# EAGLE design arduino rx (EAGLE 9.4.0)
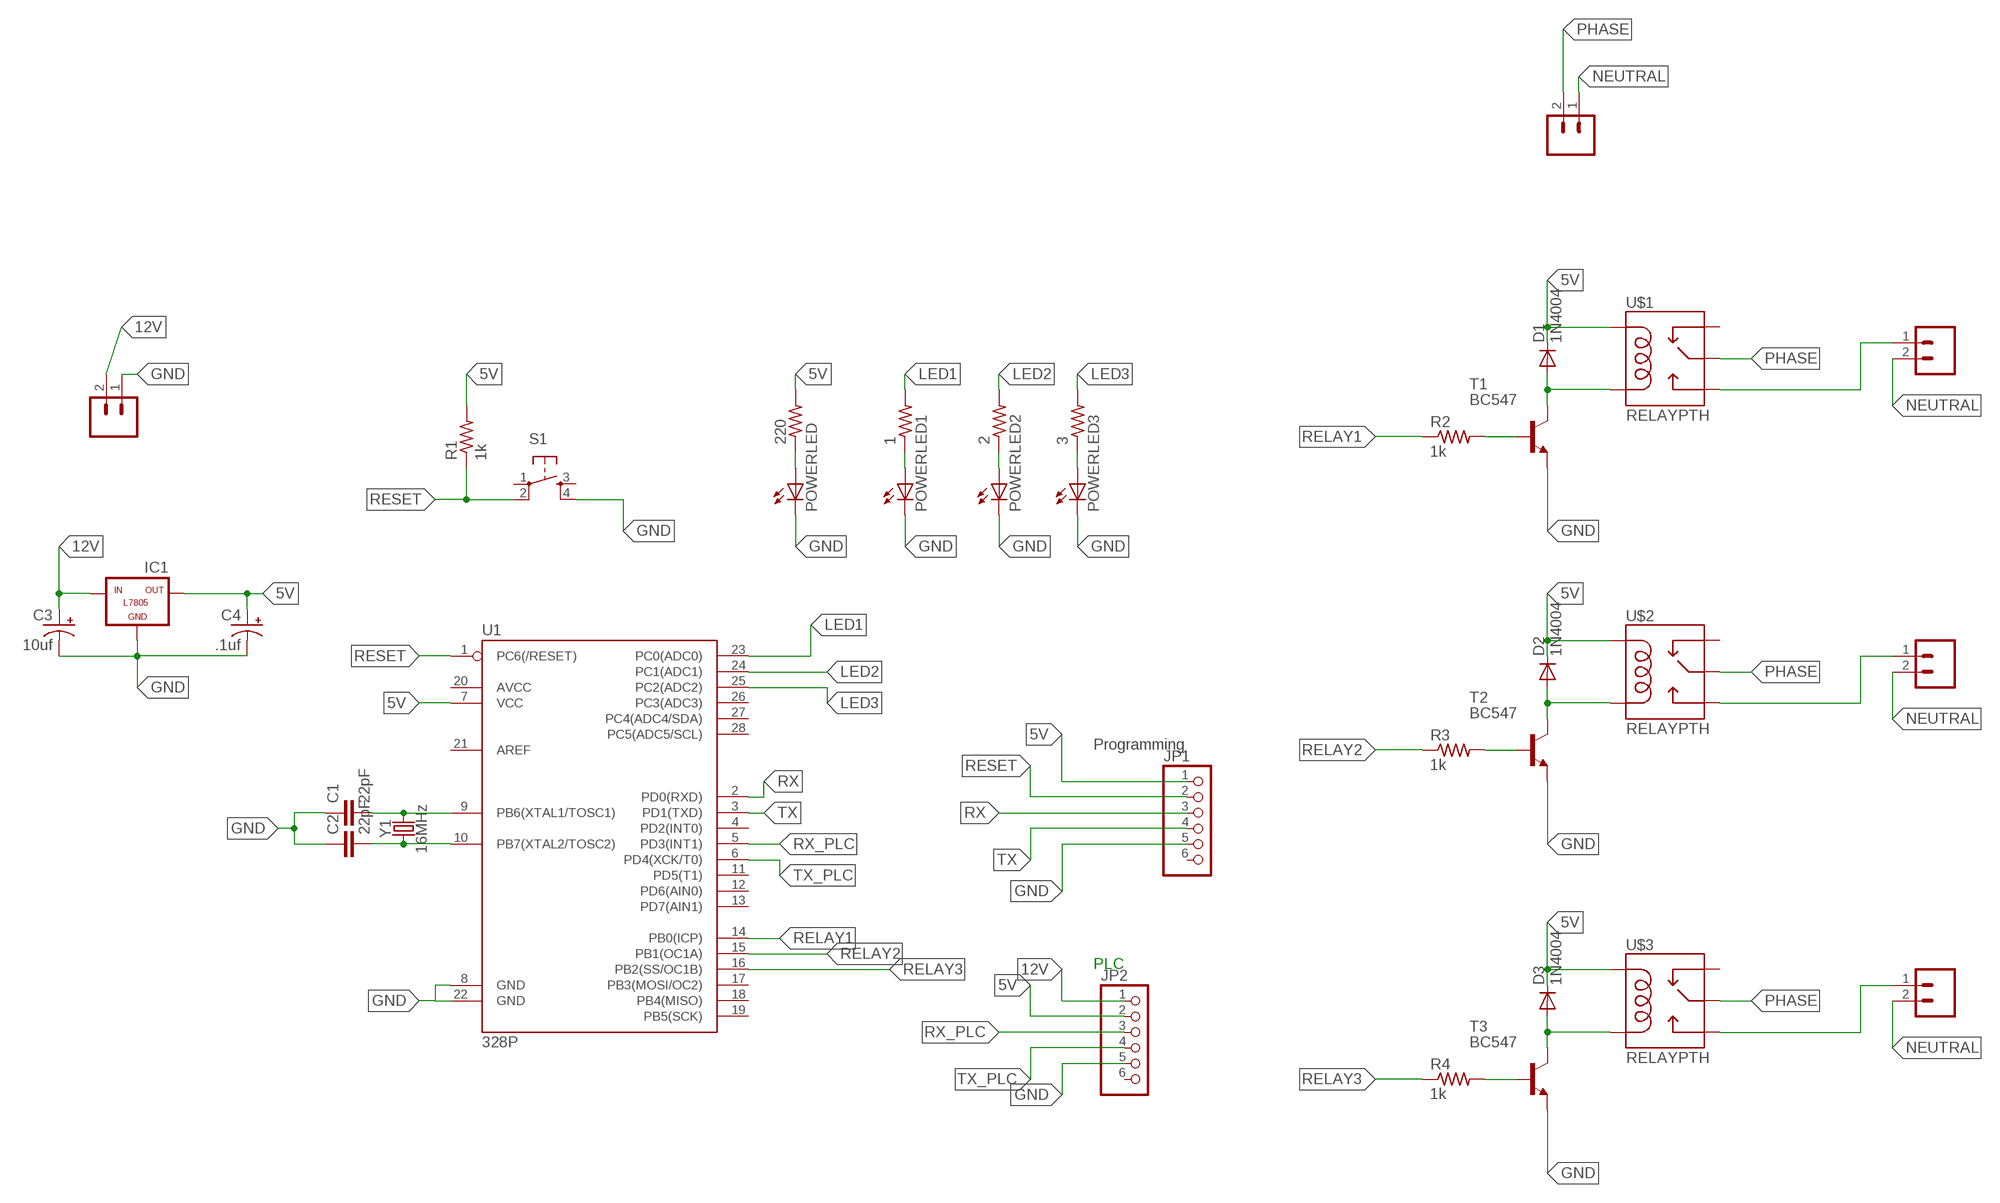
[diagram p0: schematic, sheet 1]

## Parts
1  R-US_0204/5  [0204/5]
2  R-US_0204/5  [0204/5]
3  R-US_0204/5  [0204/5]
220  R-US_0204/5  [0204/5]
C1  22pF  22PF-PTH-2.54MM-200V-5%  [CAP-PTH-2.54]
C2  22pF  22PF-PTH-2.54MM-200V-5%  [CAP-PTH-2.54]
C3  10uf  CPOL-USE5-5  [E5-5]
C4  .1uf  CPOL-USE5-5  [E5-5]
D1  1N4004  [DO41-10]
D2  1N4004  [DO41-10]
D3  1N4004  [DO41-10]
IC1  L7805  [78XXL]
J1  CONN_023.5MM  [SCREWTERMINAL-3.5MM-2]
J2  CONN_023.5MM  [SCREWTERMINAL-3.5MM-2]
J4  CONN_023.5MM  [SCREWTERMINAL-3.5MM-2]
J5  CONN_023.5MM  [SCREWTERMINAL-3.5MM-2]
J6  CONN_023.5MM  [SCREWTERMINAL-3.5MM-2]
JP1  PINHD-1X6  [1X06]
JP2  PINHD-1X6  [1X06]
POWERLED  LED5MM  [LED5MM]
POWERLED1  LED5MM  [LED5MM]
POWERLED2  LED5MM  [LED5MM]
POWERLED3  LED5MM  [LED5MM]
R1  1k  R-US_0204/5  [0204/5]
R2  1k  R-US_0204/5  [0204/5]
R3  1k  R-US_0204/5  [0204/5]
R4  1k  R-US_0204/5  [0204/5]
S1  TAC_SWITCHPTH  [TACTILE-PTH]
T1  BC547  [TO92]
T2  BC547  [TO92]
T3  BC547  [TO92]
U1  328P  ATMEGA328P_PDIP  [DIP28]
U$1  RELAYPTH  [SRD-05VDC-SL-C]
U$2  RELAYPTH  [SRD-05VDC-SL-C]
U$3  RELAYPTH  [SRD-05VDC-SL-C]
Y1  16MHz  CRYSTAL-16MHZPTH-HC49US  [HC49US]

## Nets
5V: 220.2 C4.+ D1.C D2.C D3.C IC1.OUT JP1.1 JP2.2 R1.2 U1.7(VCC) U$1.COIL1 U$2.COIL1 U$3.COIL1
12V: C3.+ IC1.IN J1.2 JP2.1
GND: C1.1 C2.1 C3.- C4.- IC1.GND J1.1 JP1.5 JP2.5 POWERLED1.K(C) POWERLED2.K(C) POWERLED3.K(C) POWERLED.K(C) S1.4 T1.1(E) T2.1(E) T3.1(E) U1.8(GND) U1.22(GND)
LED1: 1.2 U1.23(PC0(ADC0))
LED2: 2.2 U1.24(PC1(ADC1))
LED3: 3.2 U1.25(PC2(ADC2))
N$1: 220.1 POWERLED.A
N$2: C1.2 U1.9(PB6(XTAL1/TOSC1)) Y1.2
N$3: C2.2 U1.10(PB7(XTAL2/TOSC2)) Y1.1
N$4: R2.2 T1.2(B)
N$5: D1.A T1.3(C) U$1.COIL0
N$6: R3.2 T2.2(B)
N$7: D2.A T2.3(C) U$2.COIL0
N$8: J5.1 U$2.SWOPEN
N$9: J4.1 U$1.SWOPEN
N$10: J6.1 U$3.SWOPEN
N$12: R4.2 T3.2(B)
N$13: D3.A T3.3(C) U$3.COIL0
N$16: 1.1 POWERLED1.A
N$17: 2.1 POWERLED2.A
N$18: 3.1 POWERLED3.A
NEUTRAL: J2.1 J4.2 J5.2 J6.2
PHASE: J2.2 U$1.SWCOMMON U$2.SWCOMMON U$3.SWCOMMON
RELAY1: R2.1 U1.14(PB0(ICP))
RELAY2: R3.1 U1.15(PB1(OC1A))
RELAY3: R4.1 U1.16(PB2(SS/OC1B))
RESET: JP1.2 R1.1 S1.2 U1.1(PC6(/RESET))
RX: JP1.3 U1.2(PD0(RXD))
RX_PLC: JP2.3 U1.5(PD3(INT1))
TX: JP1.4 U1.3(PD1(TXD))
TX_PLC: JP2.4 U1.6(PD4(XCK/T0))
Unconnected: JP1.6 JP2.6 S1.1 S1.3 U1.4(PD2(INT0)) U1.11(PD5(T1)) U1.12(PD6(AIN0)) U1.13(PD7(AIN1)) U1.17(PB3(MOSI/OC2)) U1.18(PB4(MISO)) U1.19(PB5(SCK)) U1.20(AVCC) U1.21(AREF) U1.26(PC3(ADC3)) U1.27(PC4(ADC4/SDA)) U1.28(PC5(ADC5/SCL)) U$1.SWCLOSED(SWCLOSE) U$2.SWCLOSED(SWCLOSE) U$3.SWCLOSED(SWCLOSE)

## Notes on the sheet
- Programming
- PLC

## Library data of the parts
1-3 220 R1-R4 = adafruit:R-US_: RESISTOR, American symbol
C1 C2 = SparkFun-Capacitors:22PF: 22pF ceramic capacitors A capacitor is a passive two-terminal electrical component used to store electrical energy temporarily in an electric field.; PROD_ID: CAP-09128
C3 C4 = adafruit:CPOL-US: POLARIZED CAPACITOR, American symbol
D1-D3 = adafruit:1N4004: DIODE General purpose 1N400x type rectifier (With bigger pads) http://www.ladyada.net/library/pcb/eaglelibrary.html
IC1 = tango:L7805: VOLTAGE REGULATOR
J1 J2 J4-J6 = SparkFun-Connectors:CONN_02: Multi connection point. Often used as Generic Header-pin footprint for 0.1 inch spaced/style header connections On any of the 0.1 inch spaced packages, you can populate with these: Break Away Headers - Straight <https://www.sparkfun.com/products/116> (PRT-00116) Break Away Male Headers - Right Angle <https://www.sparkfun.com/products/553> (PRT-00553) Female Headers <https://www.sparkfun.com/products/115> (PRT-00115) Break Away Headers - Machine Pin <https://www.sparkfun.com/products/117> (PRT-00117) Break Away Female Headers - Swiss Machine Pin <https://www.sparkfun.com/products/743> (PRT-00743) For SCREWTERMINALS and SPRING TERMINALS visit here: Screw Terimnals on SparkFun.com <https://www.sparkfun.com/search/results?term=Screw+Terminals> (5mm/3.5mm/2.54mm spacing) This device is also useful as a general connection point to wire up your design to another part of your project. Our various solder wires solder well into these plated through hole pads. Hook-Up Wire - Assortment (Stranded, 22 AWG) <https://www.sparkfun.com/products/11375> (PRT-11375) Hook-Up Wire - Assortment (Solid Core, 22 AWG) <https://www.sparkfun.com/products/11367> (PRT-11367) View the entire wire category on our website here <https://www.sparkfun.com/categories/141> Special notes: Molex polarized connector foot print use with: PRT-08233 with associated crimp pins and housings. 2.54_SCREWTERM for use with PRT-10571. 3.5mm Screw Terminal footprints for PRT-08084 5mm Screw Terminal footprints for use with PRT-08432; PROD_ID: CONN-08399
JP1 JP2 = adafruit:PINHD-1X6: PIN HEADER
POWERLED POWERLED1-POWERLED3 = adafruit:LED: LED OSRAM: - CHIPLED LG R971, LG N971, LY N971, LG Q971, LY Q971, LO R971, LY R971 LH N974, LH R974 LS Q976, LO Q976, LY Q976 LO Q996 - Hyper CHIPLED LW Q18S LB Q993, LB Q99A, LB R99A - SideLED LS A670, LO A670, LY A670, LG A670, LP A670 LB A673, LV A673, LT A673, LW A673 LH A674 LY A675 LS A676, LA A676, LO A676, LY A676, LW A676 LS A679, LY A679, LG A679 - Hyper Micro SIDELED® LS Y876, LA Y876, LO Y876, LY Y876 LT Y87S - SmartLED LW L88C, LW L88S LB L89C, LB L89S, LG L890 LS L89K, LO L89K, LY L89K LS L896, LA L896, LO L896, LY L896 - TOPLED LS T670, LO T670, LY T670, LG T670, LP T670 LSG T670, LSP T670, LSY T670, LOP T670, LYG T670 LG T671, LOG T671, LSG T671 LB T673, LV T673, LT T673, LW T673 LH T674 LS T676, LA T676, LO T676, LY T676, LB T676, LH T676, LSB T676, LW T676 LB T67C, LV T67C, LT T67C, LS T67K, LO T67K, LY T67K, LW E67C LS E67B, LA E67B, LO E67B, LY E67B, LB E67C, LV E67C, LT E67C LW T67C LS T679, LY T679, LG T679 LS T770, LO T770, LY T770, LG T770, LP T770 LB T773, LV T773, LT T773, LW T773 LH T774 LS E675, LA E675, LY E675, LS T675 LS T776, LA T776, LO T776, LY T776, LB T776 LHGB T686 LT T68C, LB T68C - Hyper Mini TOPLED® LB M676 - Mini TOPLED Santana® LG M470 LS M47K, LO M47K, LY M47K Source: http://www.osram.convergy.de/
S1 = SparkFun-Retired:TAC_SWITCH: Momentary Switch Button commonly used for reset or general input. Spark Fun Electronics SKU : COM-00097 SMT- SWCH-08247
T1-T3 = transistor:BC547: NPN TRANSISTOR
U1 = SparkFun-IC-Microcontroller:ATMEGA328P_PDIP: Atmel 328P Through hole ATMEGA328P uC used in the Arduino 32kb flash, 1k EEPROM, 2k SRAM Datasheet <http://www.sparkfun.com/datasheets/Components/SMD/ATMega328.pdf> SparkFun Products Storefront component: AVR 28 Pin 20MHz 32K 6A/D - ATMega328P <https://www.sparkfun.com/products/9061> (COM-09061) SparkFun Simon Says - Through-Hole Soldering Kit <https://www.sparkfun.com/products/10547> (KIT-10547) SparkFun Learn to Solder - Simon Says <https://www.sparkfun.com/products/13708> (KIT-13708) SparkFun BigTime Watch Kit <https://www.sparkfun.com/products/11734> (KIT-11734) SparkFun ClockIt <https://www.sparkfun.com/products/10930> (KIT-10930) SparkFun Serial Enabled LCD Kit <https://www.sparkfun.com/products/10097> (LCD-10097) SparkFun Simon Tilts - Through Hole Soldering Kit <https://www.sparkfun.com/products/12634> (KIT-12634) SparkFun Frequency Counter Kit <https://www.sparkfun.com/products/10140> (KIT-10140) FabFM Radio Kit <https://www.sparkfun.com/products/11043> (KIT-11043) SparkFun Binary Blaster Kit <https://www.sparkfun.com/products/12037> (KIT-12037) SparkFun Metro-Gnome <https://www.sparkfun.com/products/9236> (KIT-09236) ATmega328 with Arduino Optiboot (Uno) <https://www.sparkfun.com/products/10524> (DEV-10524); PROD_ID: IC-09136
U$1-U$3 = SRD-05VDC-SL-C:RELAY: SPDT relay (COM-00101)
Y1 = SparkFun-Clocks:CRYSTAL-16MHZ: 16MHz Crystal Digikey Example <http://www.digikey.com/product-search/en?keywords=535-9122-1-ND> Frequency: 16MHz Frequency Stability: ±50ppm Frequency Tolerance: ±20ppm Load Capacitance: 18pF SparkFun Products: Pro Micro -5V/16MHz <https://www.sparkfun.com/products/12640> SparkFun Serial Enabled LCD Kit <https://www.sparkfun.com/products/10097>; PROD_ID: XTAL-08181; SF_ID: COM-00536

## Board
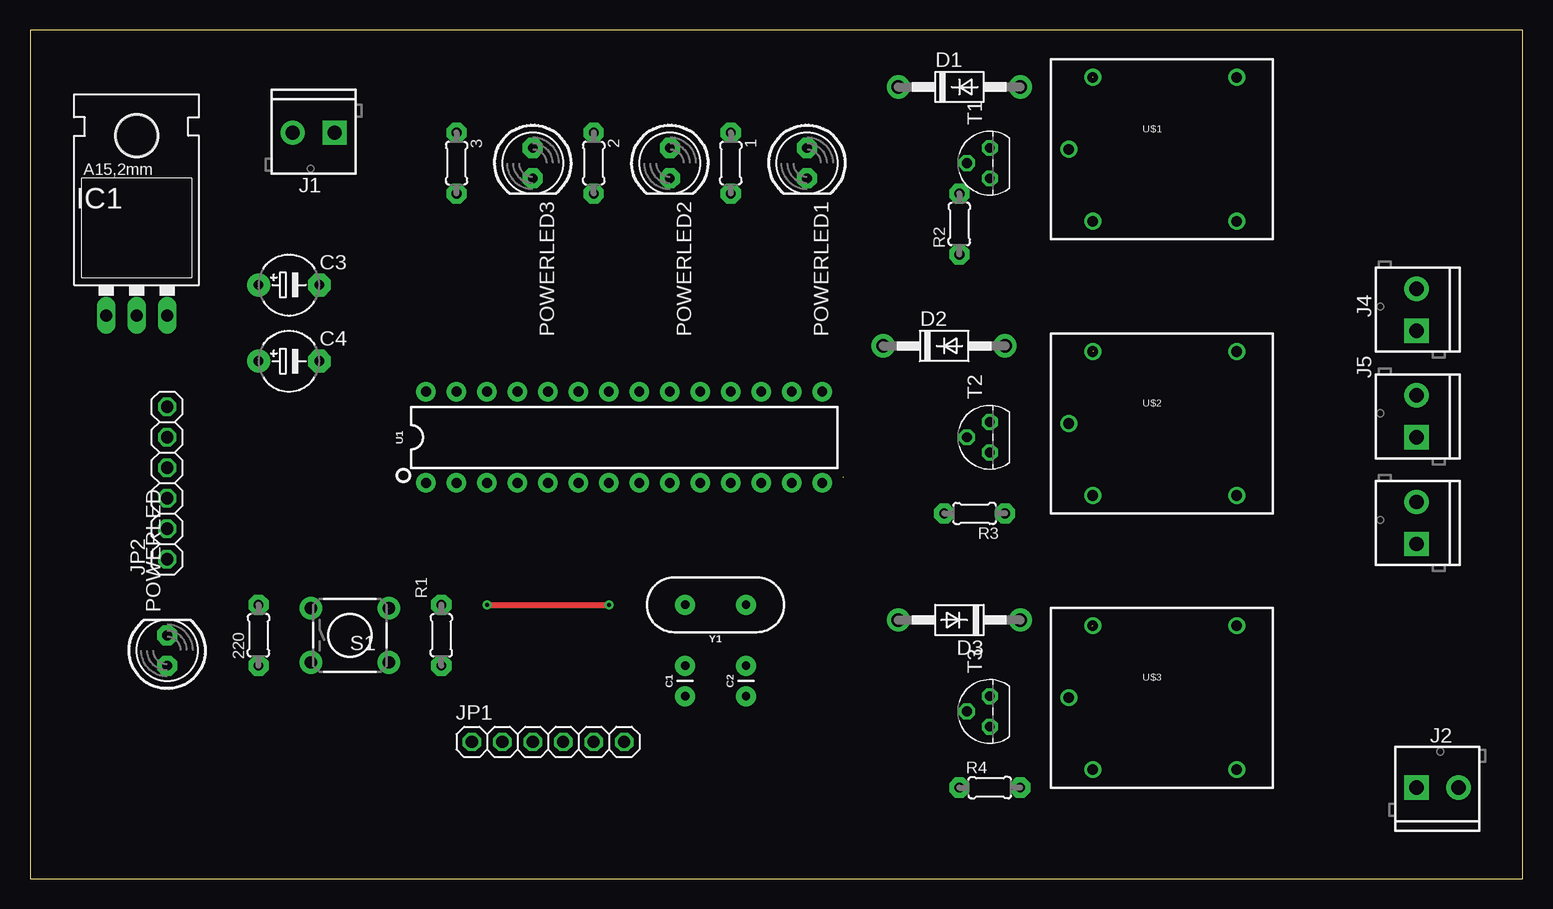
[diagram p1: board, top side]
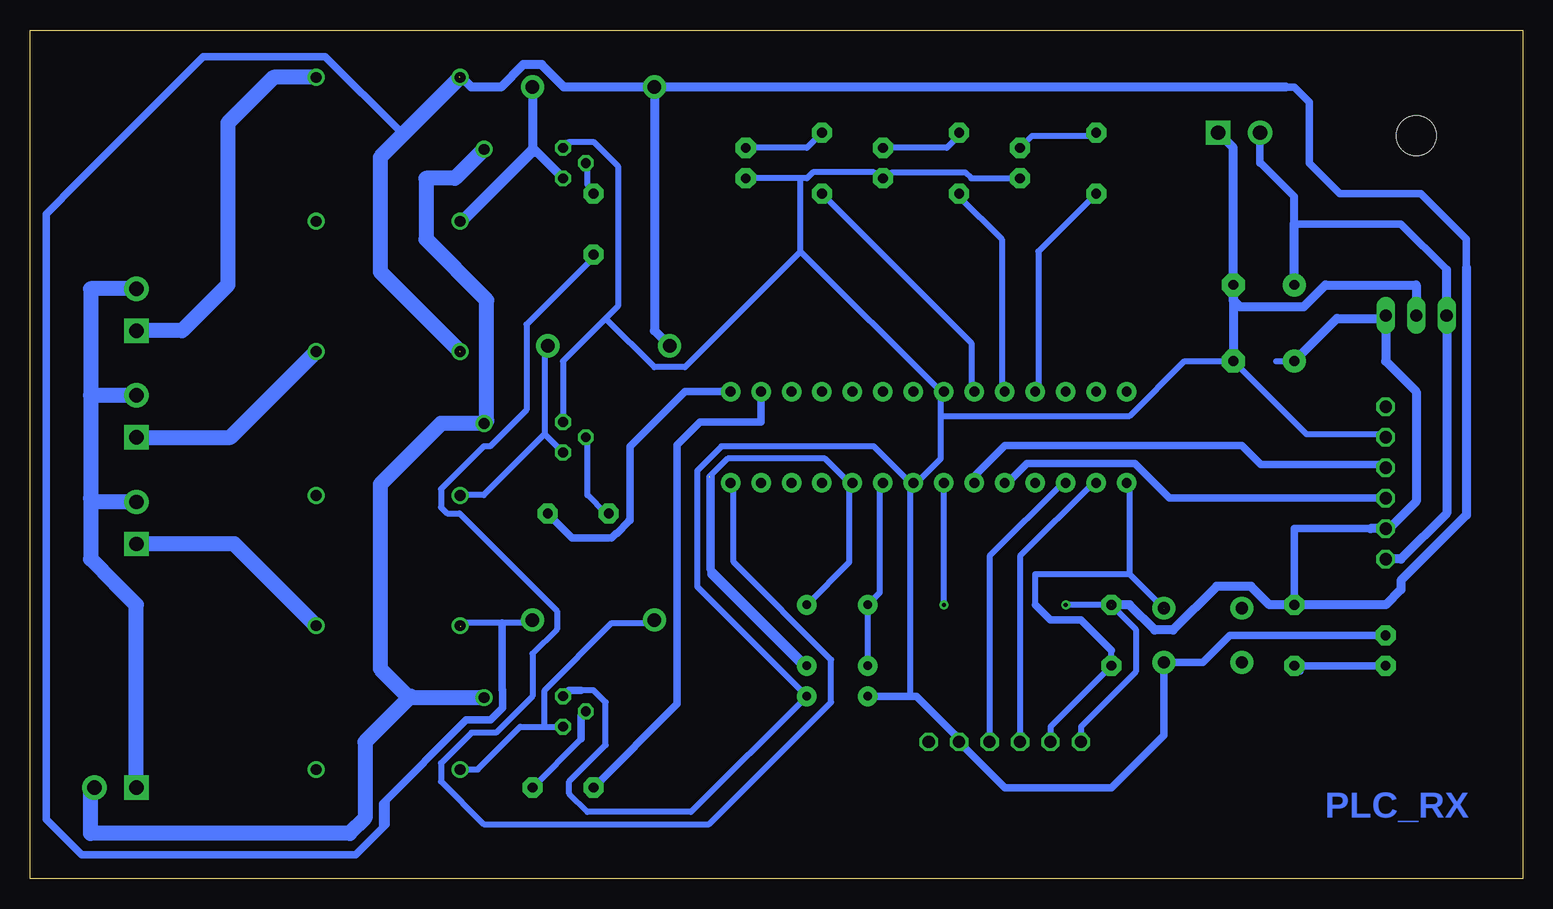
[diagram p2: board, bottom side, seen from below]

Size 124.44 x 70.79 mm. Coordinates in mm from the lower left corner, seen from the top.
Outline: 0,0 124.44,0 124.44,70.79 0,70.79 0,0
Copper layers (1*16): Top 0.035mm / dielectric 1.5mm / Bottom 0.035mm
Design rules "default *": minimum track width 20mil, minimum drill 0.35mm, track to track 20mil, track to pad 20mil, pad to pad 6mil, via to via 6mil, smd to smd 6mil, copper to edge 40mil, drill to drill 6mil, minimum pad ring 10mil, minimum via ring 8mil, stop-mask expansion 4mil, vias tented up to drill 0mil, thermal gap 10mil

### Footprints (pad centres in the part's own frame; a part is rotated, then mirrored left to right if it is on the bottom)
0204/5 = drill 0.813 pad 1.676 octagon: 1 -2.54,0; 2 2.54,0
CAP-PTH-2.54 = drill 0.7 pad 1.651: 1 -1.27,0; 2 1.27,0
E5-5 = drill 0.813 pad 1.905: + -2.54,0 | drill 0.813 pad 1.905 octagon: - 2.54,0
DO41-10 = drill 1.118 pad 1.93: A 5.08,0; C -5.08,0
78XXL = drill 1.016 long: GND 0,-3.81; IN -2.54,-3.81; OUT 2.54,-3.81 | hole 3.302: 0,11.176
SCREWTERMINAL-3.5MM-2 = drill 1.2 pad 2.032 square: 1 0,0 | drill 1.2 pad 2.032: 2 3.5,0
1X06 = drill 1.016 octagon: 1 -6.35,0; 2 -3.81,0; 3 -1.27,0; 4 1.27,0; 5 3.81,0; 6 6.35,0
LED5MM = drill 0.813 pad 1.676 octagon: A -1.27,0; K 1.27,0
TACTILE-PTH = drill 1.016 pad 1.88: 1 -3.251,2.261; 2 3.251,2.261; 3 -3.251,-2.261; 4 3.251,-2.261
TO92 = drill 0.813 octagon: 1 1.27,0; 2 0,1.905; 3 -1.27,0
DIP28 = drill 0.813 pad 1.626: 1 -16.51,-3.81; 2 -13.97,-3.81; 3 -11.43,-3.81; 4 -8.89,-3.81; 5 -6.35,-3.81; 6 -3.81,-3.81; 7 -1.27,-3.81; 8 1.27,-3.81; 9 3.81,-3.81; 10 6.35,-3.81; 11 8.89,-3.81; 12 11.43,-3.81; 13 13.97,-3.81; 14 16.51,-3.81; 15 16.51,3.81; 16 13.97,3.81; 17 11.43,3.81; 18 8.89,3.81; 19 6.35,3.81; 20 3.81,3.81; 21 1.27,3.81; 22 -1.27,3.81; 23 -3.81,3.81; 24 -6.35,3.81; 25 -8.89,3.81; 26 -11.43,3.81; 27 -13.97,3.81; 28 -16.51,3.81
SRD-05VDC-SL-C = drill 0.9: COIL0 -5.39,-6.12; COIL1 -5.39,5.88; SWCLOSED 6.61,-6.12; SWCOMMON -7.39,-0.12; SWOPEN 6.61,5.88
HC49US = drill 0.7 pad 1.651: 1 -2.54,0; 2 2.54,0

### Placement (x,y rotation side)
1  58.42,59.69 270 top
2  46.99,59.69 270 top
3  35.56,59.69 270 top
220  19.05,20.32 90 top
C1  54.61,16.51 90 top
C2  59.69,16.51 90 top
C3  21.59,49.53 0 top
C4  21.59,43.18 0 top
D1  77.47,66.04 0 top
D2  76.2,44.45 0 top
D3  77.47,21.59 180 top
IC1  8.89,50.8 0 top
J1  25.4,62.23 180 top
J2  115.57,7.62 0 top
J4  115.57,45.72 90 top
J5  115.57,36.83 90 top
J6  115.57,27.94 90 top
JP1  43.18,11.43 0 top
JP2  11.43,33.02 90 top
POWERLED  11.43,19.05 90 top
POWERLED1  64.77,59.69 270 top
POWERLED2  53.34,59.69 270 top
POWERLED3  41.91,59.69 270 top
R1  34.29,20.32 90 top
R2  77.47,54.61 90 top
R3  78.74,30.48 180 top
R4  80.01,7.62 0 top
S1  26.67,20.32 0 top
T1  80.01,59.69 90 top
T2  80.01,36.83 90 top
T3  80.01,13.97 90 top
U1  49.53,36.83 0 top
U$1  93.98,60.96 0 top
U$2  93.98,38.1 0 top
U$3  93.98,15.24 0 top
Y1  57.15,22.86 180 top

### Tracks (layer width: path | path; a pad name or v marks a point on that pad's centre or on a via)
5V  (via drill 0.35)  (6 unrouted)
  Top 0.508: v38.1,22.86 v48.26,22.86
  Bottom 0.508: 88.9,43.81 88.63,44.02 | 88.58,66.99 U$1.COIL1 | 88.86,66.64 88.63,66.88 | JP1.1 36.83,12.7 32.26,17.27 32.26,20.83 R1.2 v38.1,22.86 | 11.43,28.96 JP2.2 11.43,29.46 | 11.43,43.18 11.43,46.74 IC1.OUT | 85.09,21.34 82.55,21.34 D3.C | 85.09,21.34 88.14,21.34 88.53,21.06 | 88.62,44.2 88.62,43.98 | 88.62,66.84 88.65,66.55 93.22,61.98 99.82,68.58 109.98,68.58 120.4,58.17 121.16,57.4 | 85.09,21.34 85.09,14.22 86.11,13.21 88.14,13.21 94.74,6.6 94.74,6.35 | 114.55,2.03 97.79,2.03 | 20.57,43.18 C4.+ | v48.26,22.86 U1.7
  Bottom 0.635: 93.59,61.84 93.59,62.35 99.82,68.58 109.98,68.58 120.4,58.17 123.11,55.46 123.11,5 120.14,2.03 97.79,2.03 97.28,2.03 94.74,4.57 94.74,6.35 | 85.09,21.34 85.09,15.78 85.06,15.75 85.06,14.26 86.05,13.27 88.08,13.27 95.06,6.29 95.06,4.47 | 4.7,50.8 4.7,53.34 8.51,57.15 15.24,57.15 17.78,59.69 17.78,64.77 19.05,66.04 19.79,66.04 | 12.7,29.21 19.05,29.21 220.2
  Bottom 0.762: C4.+ 15.49,46.74 11.43,46.74 | IC1.OUT 11.43,43.18 8.89,40.64 8.89,31.5 11.43,28.96 | R1.2 32.79,22.86 30.68,20.75 29.16,20.75 25.51,24.41 22.66,24.41 21.11,22.86 220.2 11.43,22.86 10.16,24.13 10.16,24.87 4.7,30.34 4.7,50.8 4.7,50.95 | D1.C 72.39,45.72 D2.C | 88.58,66.99 87.63,66.04 85.17,66.04 83.32,67.89 81.78,67.89 79.93,66.04 D1.C | 11.68,29.21 JP2.2 | 11.68,29.21 12.7,29.21 | 11.68,29.21 11.43,29.46 | 19.79,66.04 D1.C
  Bottom 1.27: U$2.COIL1 95.25,50.64 95.25,60.18 93.59,61.84 U$1.COIL1
12V
  Bottom 0.508: IC1.IN 6.35,50.29
  Bottom 0.635: 6.35,50.8 10.16,54.61 19.05,54.61 | J1.2 21.9,59.69 21.84,59.69 19.05,56.9 19.05,54.61 | 19.05,54.61 19.11,54.67 19.11,56.9
  Bottom 0.762: C3.+ 19.05,54.61 | JP2.1 10.16,26.67 6.35,30.48 IC1.IN 6.35,50.8
GND
  Bottom 0.508: 78.49,15.75 77.47,15.75 76.45,14.73 76.45,11.18 79.5,8.13 79.5,7.11 77.98,5.59 69.34,5.59 C2.1 68.83,24.38 68.83,34.04 66.8,36.07 54.1,36.07 51.05,33.02 | T2.1 80.01,43.18 76.45,46.74 | 76.45,46.74 75.44,47.75 75.44,59.44 77.47,61.47 79.5,61.47 T1.1 | POWERLED3.K 45.97,58.42 46.48,58.93 52.58,58.93 53.09,58.42 POWERLED2.K 53.59,58.42 54.1,58.93 59.18,58.93 59.69,58.42 60.2,58.42 | 60.2,58.42 POWERLED1.K | JP2.5 11.43,37.08 18.03,37.08 C4.- 28.19,43.18 32.77,38.61 48.51,38.61 | 48.51,38.61 48.51,35.05 50.55,33.02 U1.8 51.05,33.02 | 48.51,38.61 48.51,40.64 | C1.1 51.05,15.24 | 50.55,15.24 51.05,15.24 | 51.05,15.24 51.05,33.02 | 46.99,11.18 JP1.5 | 60.2,52.32 60.2,58.42 | 48.51,40.64 60.2,52.32 | 48.51,40.64 U1.22 | 76.45,46.74 72.39,42.67 69.85,42.67 60.2,52.32 | 24.13,58.93 C3.-
  Bottom 0.635: 78.49,15.75 79.5,15.75 T3.1 | C1.1 50.55,15.24 46.99,11.68 JP1.5 43.18,7.62 34.29,7.62 29.92,11.99 S1.4 26.67,18.06 24.41,20.32 POWERLED.K
  Bottom 0.762: C3.- 24.13,60.96 J1.1 | IC1.GND 8.89,49.53 16.45,49.53 18.29,47.69 23.56,47.69 24.13,48.26 C3.- | C3.- C4.-
LED1
  Bottom 0.508: 1.2 45.97,44.7 45.97,40.64 U1.23
LED2
  Bottom 0.508: U1.24 43.43,40.64 43.43,53.34 46.99,56.9 2.2
LED3
  Bottom 0.508: 3.2 40.39,52.32 40.39,40.64 U1.25
N$1
  Bottom 0.508: 18.54,17.27 220.1
  Bottom 0.635: POWERLED.A 220.1
N$2
  Bottom 0.508: U1.9 53.59,33.02 53.59,23.88 Y1.2 C1.2
N$3  (1 unrouted)
  Bottom 0.508: 56.13,33.02 56.13,26.42 Y1.1 | 67.82,26.92 67.82,33.53 66.29,35.05 58.17,35.05 56.13,33.02 | 56.13,33.02 U1.10
  Bottom 0.635: C2.2 67.75,25.84 67.75,33.53 67.68,33.53 67.68,25.4 60.06,17.78 C2.2
N$4
  Bottom 0.508: 78.14,59.66 77.95,59.47 77.98,57.91 77.47,57.4 R2.2
N$5
  Bottom 0.508: 88.59,54.93 U$1.COIL0 | 82.55,60.96 82.04,60.45 | 82.04,60.45 T1.3 | 82.04,60.45 82.55,60.45 88.14,54.85 88.59,54.85
  Bottom 0.762: D1.A 82.55,60.96 | 82.55,60.96 T1.3 | 82.55,60.96 82.55,60.88 U$1.COIL0
N$6
  Bottom 0.508: 78.14,36.8 77.98,36.58 77.98,32 76.45,30.48 R3.2
N$7
  Bottom 0.508: 81.53,37.08 T2.3 | 81.53,37.08 81.53,44.2 D2.A | 81.53,37.08 86.61,32 88.14,32 88.59,31.99
N$8
  Bottom 1.27: U$2.SWOPEN 107.74,36.83 J5.1
N$9
  Bottom 1.27: U$1.SWOPEN 104.14,66.84 107.95,63.03 107.95,49.53 111.76,45.72 J4.1
N$10
  Bottom 1.27: U$3.SWOPEN 107.41,27.94 J6.1
N$12
  Bottom 0.508: 78.49,11.68 R4.2
  Bottom 0.635: T3.2 78.49,13.59 78.49,11.68
N$13
  Bottom 0.508: 88.59,9.21 U$3.COIL0 | 81.53,12.7 83.57,12.7 87.12,9.14 88.14,9.13 88.59,9.13 | 81.53,12.7 T3.3 | 81.53,12.7 81.53,15.75 75.95,21.34 72.39,21.34 D3.A
N$16
  Bottom 0.508: POWERLED1.A 59.69,60.96 1.1
N$17
  Bottom 0.508: POWERLED2.A 48.01,60.96 46.99,61.98 2.1
N$18
  Bottom 0.508: POWERLED3.A 40.89,61.98 35.81,61.98 3.1
NEUTRAL
  Bottom 1.27: J5.2 119.38,40.33 | J4.2 119.38,49.22 119.38,40.33 | 119.38,40.33 119.38,31.75 | 119.38,31.75 119.38,26.67 117.37,24.66 115.57,22.86 J2.1 | J6.2 119.07,31.44 119.38,31.75
PHASE
  Bottom 1.27: U$3.SWCOMMON 92.83,15.12 | 92.83,15.12 96.52,11.43 96.52,5.08 97.79,3.81 119.38,3.81 119.38,7.31 J2.2 | 86.48,37.98 U$2.SWCOMMON | 92.83,15.12 92.71,15.24 | U$1.SWCOMMON 89.01,58.42 91.44,58.42 91.44,53.34 86.36,48.26 86.36,38.21 U$2.SWCOMMON | 92.83,15.12 95.25,17.54 95.25,32.9 90.17,37.98 U$2.SWCOMMON
RELAY1
  Bottom 0.508: U1.14 65.79,33.02 65.79,26.42 57.66,18.29 57.66,14.73 67.82,4.57 86.61,4.57 90.17,8.13 90.17,9.65 87.63,12.19 85.6,12.19 82.55,15.24 82.55,18.8 80.52,20.83 80.52,22.35 88.65,30.48 89.66,30.48 90.17,30.99 90.17,32.51 86.61,36.07 86.11,36.07 83.06,39.12 83.06,46.23 77.47,51.82 R2.1
RELAY2
  Bottom 0.508: 76.2,28.45 75.95,28.45
  Bottom 0.635: 74.54,29.79 74.42,29.91 74.42,29.97 | 74.42,29.97 74.42,36.07 69.85,40.64 U1.15 | 74.42,29.97 74.54,29.86 74.54,29.79 | 74.54,29.79 75.51,28.82 75.58,28.82 75.95,28.45 | R3.1 79.25,28.45 76.2,28.45
RELAY3
  Bottom 0.508: 63.75,40.64 U1.16
  Bottom 0.635: U1.16 63.5,38.1 68.58,38.1 70.48,36.2 70.48,14.61 R4.1
RESET  (1 unrouted)
  Bottom 0.508: JP1.2 39.37,12.7 R1.1 34.29,19.05 | 32.77,25.4 32.77,33.02 U1.1 | 32.77,25.4 30.22,22.87 S1.2 | 32.77,25.4 40.64,25.4 40.64,22.86
  Bottom 0.635: 34.29,19.05 36.83,21.59 39.37,21.59 40.64,22.86
RX
  Bottom 0.508: JP1.3 41.91,26.92 35.81,33.02 U1.2
RX_PLC
  Bottom 0.635: U1.5 42.96,33.02 41.32,34.66 32.34,34.66 31.38,33.7 31.38,33.67 29.46,31.75 JP2.3
TX
  Bottom 0.508: JP1.4 44.45,26.92 38.35,33.02 U1.3
TX_PLC
  Bottom 0.508: JP2.4 11.43,34.54
  Bottom 0.635: 11.43,34.54 21.84,34.54 23.43,36.13 40.64,36.13 41.34,36.13 43.18,36.13 45.72,33.59 U1.6

### Text on the board
Bottom: PLC_RX